# Altium project Sleek Imponator.PrjPcb
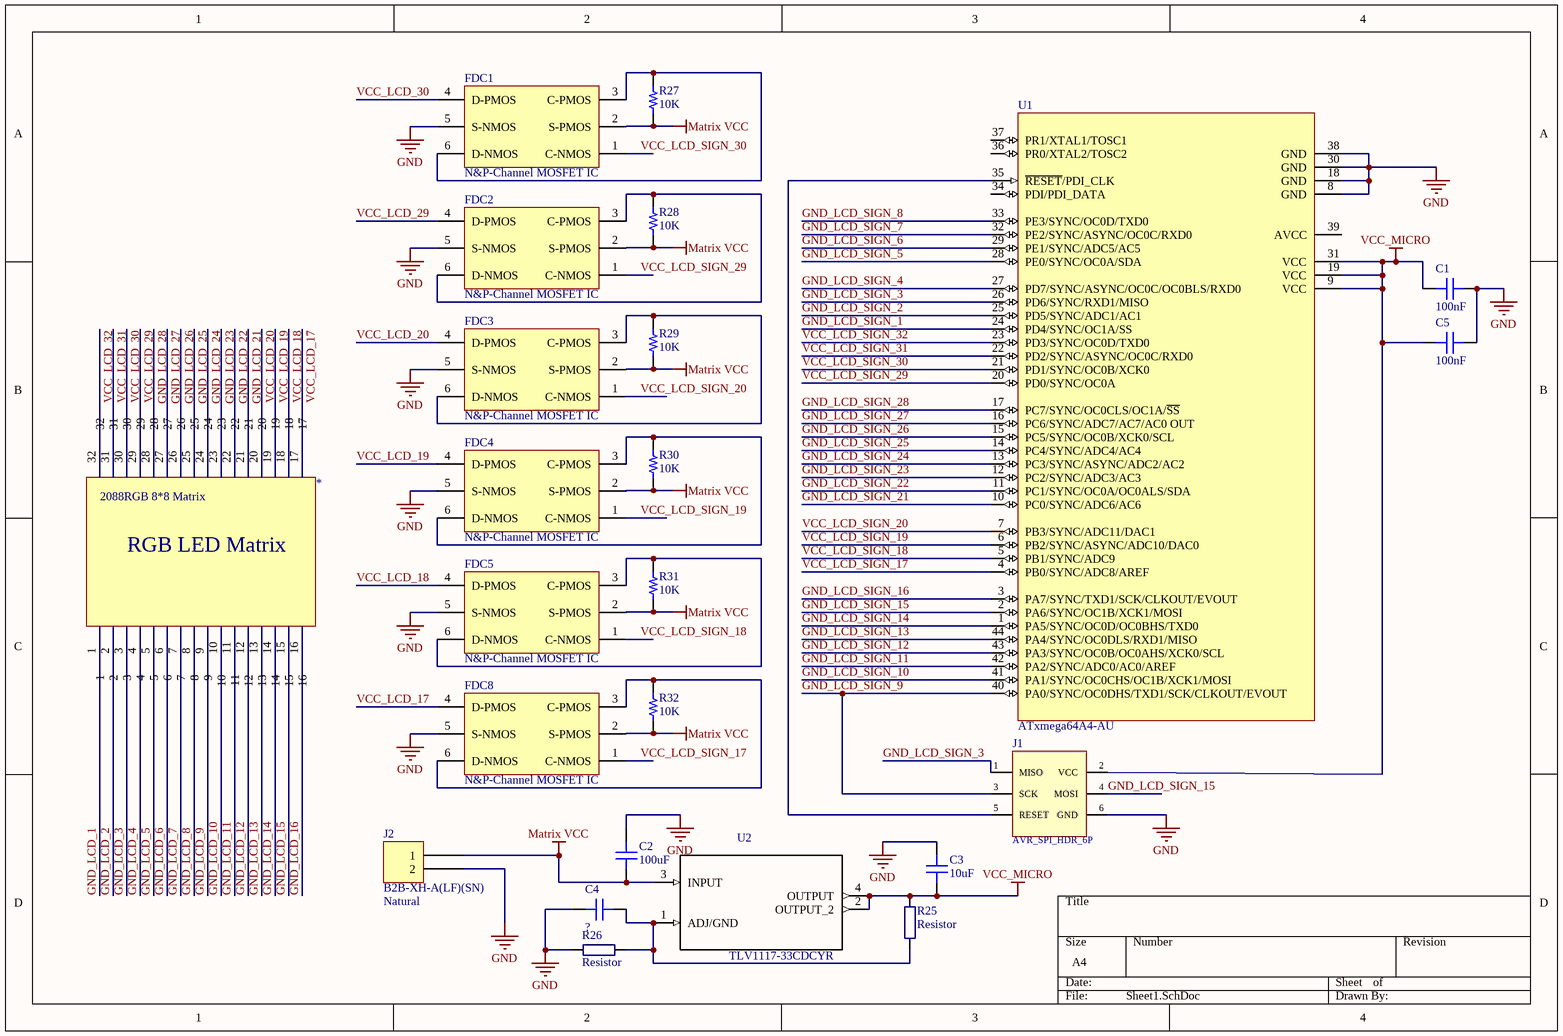
[diagram p0: Sheet1.SchDoc]
2 sheets, 76 parts. Net scope: global (net labels, ports and power ports of the same name join across sheets).
Board file: PCB1.PcbDoc
Sheets:
  Sheet1.SchDoc
  Sheet2.SchDoc

## Sheet Sheet1.SchDoc
size A4

### Parts
*  2088RGB 8*8 Matrix  [PCBComponent_1]
C1  100nF  [CAP 0603/1608]
C2  100uF  [CAP 0603/1608]
C3  10uF  [CAP 0603/1608]
C4  ?  [CAP 0603/1608]
C5  100nF  [CAP 0603/1608]
FDC1  N&P-Channel MOSFET IC  [SSOT-6]
FDC2  N&P-Channel MOSFET IC  [SSOT-6]
FDC3  N&P-Channel MOSFET IC  [SSOT-6]
FDC4  N&P-Channel MOSFET IC  [SSOT-6]
FDC5  N&P-Channel MOSFET IC  [SSOT-6]
FDC8  N&P-Channel MOSFET IC  [SSOT-6]
J1  AVR_SPI_HDR_6P  [HEADER_3x2]
J2  B2B-XH-A(LF)(SN)  Colour: Natural  [JST XH B2B-XH-A]
R25  Resistor  [RESC0603(1608)_N]
R26  Resistor  [RESC0603(1608)_N]
R27  10K  [RES 0603/1608]
R28  10K  [RES 0603/1608]
R29  10K  [RES 0603/1608]
R30  10K  [RES 0603/1608]
R31  10K  [RES 0603/1608]
R32  10K  [RES 0603/1608]
U1  ATxmega64A4-AU  [44A_N]
U2  TLV1117-33CDCYR  [SOT230P700X180-4N]

### Nets
GND: C1.2 C2.2 C3.2 C4.2 C5.2 FDC1.5(S-NMOS) FDC2.5(S-NMOS) FDC3.5(S-NMOS) FDC4.5(S-NMOS) FDC5.5(S-NMOS) FDC8.5(S-NMOS) J1.6(GND) J2.2 R26.1 U1.8(GND) U1.18(GND) U1.30(GND) U1.38(GND)
Matrix VCC: C2.1 FDC1.2(S-PMOS) FDC2.2(S-PMOS) FDC3.2(S-PMOS) FDC4.2(S-PMOS) FDC5.2(S-PMOS) FDC8.2(S-PMOS) J2.1 R27.1 R28.1 R29.1 R30.1 R31.1 R32.1 U2.3(INPUT)
VCC_MICRO: C1.1 C3.1 C5.1 J1.2(VCC) R25.2 U1.9(VCC) U1.19(VCC) U1.31(VCC) U2.2(OUTPUT_2) U2.4(OUTPUT)
GND_LCD_1: *.1
GND_LCD_2: *.2
GND_LCD_3: *.3
GND_LCD_4: *.4
GND_LCD_5: *.5
GND_LCD_6: *.6
GND_LCD_7: *.7
GND_LCD_8: *.8
GND_LCD_9: *.9
GND_LCD_10: *.10
GND_LCD_11: *.11
GND_LCD_12: *.12
GND_LCD_13: *.13
GND_LCD_14: *.14
GND_LCD_15: *.15
GND_LCD_16: *.16
GND_LCD_21: *.21
GND_LCD_22: *.22
GND_LCD_23: *.23
GND_LCD_24: *.24
GND_LCD_25: *.25
GND_LCD_26: *.26
GND_LCD_27: *.27
GND_LCD_28: *.28
GND_LCD_SIGN_1: U1.24(PD4/SYNC/OC1A/SS)
GND_LCD_SIGN_2: U1.25(PD5/SYNC/ADC1/AC1)
GND_LCD_SIGN_3: J1.1(MISO) U1.26(PD6/SYNC/RXD1/MISO)
GND_LCD_SIGN_4: U1.27(PD7/SYNC/ASYNC/OC0C/OC0BLS/RXD0)
GND_LCD_SIGN_5: U1.28(PE0/SYNC/OC0A/SDA)
GND_LCD_SIGN_6: U1.29(PE1/SYNC/ADC5/AC5)
GND_LCD_SIGN_7: U1.32(PE2/SYNC/ASYNC/OC0C/RXD0)
GND_LCD_SIGN_8: U1.33(PE3/SYNC/OC0D/TXD0)
GND_LCD_SIGN_9: J1.3(SCK) U1.40(PA0/SYNC/OC0DHS/TXD1/SCK/CLKOUT/EVOUT)
GND_LCD_SIGN_10: U1.41(PA1/SYNC/OC0CHS/OC1B/XCK1/MOSI)
GND_LCD_SIGN_11: U1.42(PA2/SYNC/ADC0/AC0/AREF)
GND_LCD_SIGN_12: U1.43(PA3/SYNC/OC0B/OC0AHS/XCK0/SCL)
GND_LCD_SIGN_13: U1.44(PA4/SYNC/OC0DLS/RXD1/MISO)
GND_LCD_SIGN_14: U1.1(PA5/SYNC/OC0D/OC0BHS/TXD0)
GND_LCD_SIGN_15: J1.4(MOSI) U1.2(PA6/SYNC/OC1B/XCK1/MOSI)
GND_LCD_SIGN_16: U1.3(PA7/SYNC/TXD1/SCK/CLKOUT/EVOUT)
GND_LCD_SIGN_21: U1.10(PC0/SYNC/ADC6/AC6)
GND_LCD_SIGN_22: U1.11(PC1/SYNC/OC0A/OC0ALS/SDA)
GND_LCD_SIGN_23: U1.12(PC2/SYNC/ADC3/AC3)
GND_LCD_SIGN_24: U1.13(PC3/SYNC/ASYNC/ADC2/AC2)
GND_LCD_SIGN_25: U1.14(PC4/SYNC/ADC4/AC4)
GND_LCD_SIGN_26: U1.15(PC5/SYNC/OC0B/XCK0/SCL)
GND_LCD_SIGN_27: U1.16(PC6/SYNC/ADC7/AC7/AC0_OUT)
GND_LCD_SIGN_28: U1.17(PC7/SYNC/OC0CLS/OC1A/~{SS})
VCC_LCD_17: *.17 FDC8.4(D-PMOS)
VCC_LCD_18: *.18 FDC5.4(D-PMOS)
VCC_LCD_19: *.19 FDC4.4(D-PMOS)
VCC_LCD_20: *.20 FDC3.4(D-PMOS)
VCC_LCD_29: *.29 FDC2.4(D-PMOS)
VCC_LCD_30: *.30 FDC1.4(D-PMOS)
VCC_LCD_31: *.31
VCC_LCD_32: *.32
VCC_LCD_SIGN_17: FDC8.1(C-NMOS) U1.4(PB0/SYNC/ADC8/AREF)
VCC_LCD_SIGN_18: FDC5.1(C-NMOS) U1.5(PB1/SYNC/ADC9)
VCC_LCD_SIGN_19: FDC4.1(C-NMOS) U1.6(PB2/SYNC/ASYNC/ADC10/DAC0)
VCC_LCD_SIGN_20: FDC3.1(C-NMOS) U1.7(PB3/SYNC/ADC11/DAC1)
VCC_LCD_SIGN_29: FDC2.1(C-NMOS) U1.20(PD0/SYNC/OC0A)
VCC_LCD_SIGN_30: FDC1.1(C-NMOS) U1.21(PD1/SYNC/OC0B/XCK0)
VCC_LCD_SIGN_31: U1.22(PD2/SYNC/ASYNC/OC0C/RXD0)
VCC_LCD_SIGN_32: U1.23(PD3/SYNC/OC0D/TXD0)
NetC4_1: C4.1 R25.1 R26.2 U2.1(ADJ/GND)
NetFDC1_3: FDC1.3(C-PMOS) FDC1.6(D-NMOS) R27.2
NetFDC2_3: FDC2.3(C-PMOS) FDC2.6(D-NMOS) R28.2
NetFDC3_3: FDC3.3(C-PMOS) FDC3.6(D-NMOS) R29.2
NetFDC4_3: FDC4.3(C-PMOS) FDC4.6(D-NMOS) R30.2
NetFDC5_3: FDC5.3(C-PMOS) FDC5.6(D-NMOS) R31.2
NetFDC8_3: FDC8.3(C-PMOS) FDC8.6(D-NMOS) R32.2
NetJ1_5: J1.5(RESET) U1.35(~{RESET}/PDI_CLK)

Not connected (* = marked no-connect by the designer): U1 34(PDI/PDI_DATA) 36(PR0/XTAL2/TOSC2) 37(PR1/XTAL1/TOSC1) 39(AVCC)

### Notes on the sheet
- (in symbol 2088RGB 8*8 Matrix) RGB LED Matrix

### Library data of the parts
* = 2088RGB 8*8 Matrix: 8*8 RGB Led Matrix; Model: 2088RGB-1; Schematic: http://selfbuilt.net/datasheets/2088RGB-5-datasheet.jpg
C1-C5 = C1608C0G1H820J080AA: CAP CER 82PF 50V C0G 0603; Manufacturer: TDK Corporation; TemperatureRange: -55C ~ 125C; TemperatureCoefficient: C0G, NP0; Tolerance: 5%; Supplier 1: Digi-Key; ComponentLink1Description: Datasheet; ComponentLink1URL: https://product.tdk.com/info/en/catalog/datasheets/mlcc_commercial_general_en.pdf; ComponentLink2Description: Digi-Key listing; Voltage: 50V; Type: -; Device Package: 0603 (1608 Metric)
  C1 C5: Value: 100nF
  C2: Value: 100uF
  C3: Value: 10uF
  C4: Value: ?
FDC1-FDC5 FDC8 = FDC633C: Schematic: http://www.mouser.com/ds/2/149/FDC6333C-1007236.pdf; Package: SSOT-8
J2 = B2B-XH-A(LF)(SN): CONN HEADER XH TOP 2POS 2.5MM; Manufacturer: JST Sales America Inc.; Pitch: 0.098" (2.50mm); Number Of Positions: 2; Part Number: B2B-XH-A(LF)(SN); PartId: 16449; Supplier 1: Digi-Key; Supplier Part Number 1: 455-2247-ND; ComponentLink1Description: Datasheet; ComponentLink1URL: http://www.jst-mfg.com/product/pdf/eng/eXH.pdf; ComponentLink2Description: Digi-Key Listing; ComponentLink2URL: http://www.digikey.com/product-detail/en/jst-sales-america-inc/B2B-XH-A(LF)(SN)/455-2247-ND/1651045; Price: 0,15; Type: Header, Shrouded; Contact Finish: Tin; Fastening Type: Detent Lock; Number Of Rows: 1; Series: XH
R27-R32 = ERJ-3EKF2320V: RES SMD 232 OHM 1% 1/10W 0603; Value: 10K; Part Number: ERJ-3EKF2320V
U1 = ATxmega64A4-AU: 8/16-bit AVR XMEGA A4 Microcontroller, 1.6-3.6V, 64KB + 4KB Flash, 2KB EEPROM, 4KB SRAM, 44-pin TQFP, Industrial Grade (-40°C to 85°C), Pb-Free; Published: 1-Apr-2010; DatasheetVersion: revN, Feb-2010; PackageVersion: rev.B, Oct-2001; PackageReference: 44A; Publisher: Altium Limited; PackageDescription: 44-Pin Plastic Thin Profile Quad Flat Pack, 10 x 10 x 1.0 mm Body, 0.8 mm Pitch (TQFP); Supplier 1: Digi-Key; Supplier Part Number 1: ATXMEGA64A4-AU-ND; Supplier 2: Farnell; Supplier Part Number 2: 1748560; Supplier 3: Mouser; Supplier Part Number 3: 556-ATXMEGA64A4-AU; ComponentLink1Description: Manufacturer Link; ComponentLink1URL: http://www.atmel.com/products/avr/default.asp?; ComponentLink2Description: ATxmega16A4/32A4/64A4/128A4 Datasheet; ComponentLink2URL: http://www.atmel.com/dyn/resources/prod_documents/doc8069.pdf; ComponentLink3Description: Atmel.com Home; ComponentLink3URL: http://www.atmel.com
U2 = TLV1117-33CDCYR: IC REG LIN 3.3V 800MA SOT223-4; MF: Texas Instruments; Availability: Good; Price: 0.35 USD; Package: SOT-223-4 Texas Instruments; MP: TLV1117-33CDCYR; Value: *
R25 R26 = Resistor: Value: ?

## Sheet Sheet2.SchDoc
size A4
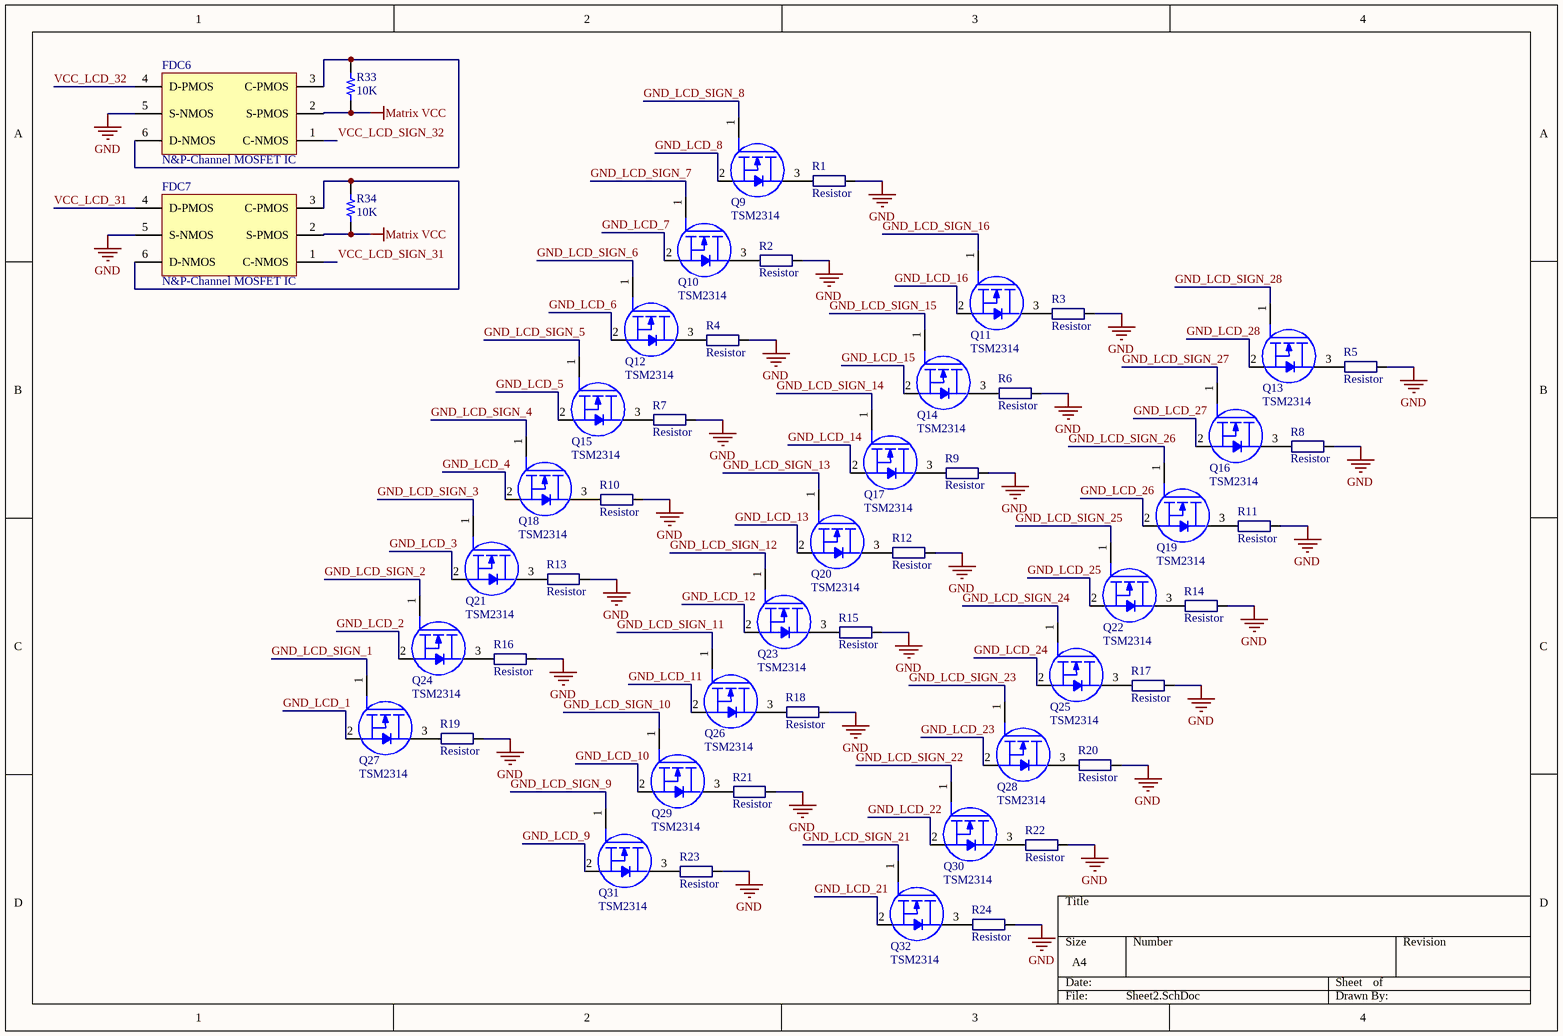
[diagram p1: Sheet2.SchDoc]

### Parts
FDC6  N&P-Channel MOSFET IC  [SSOT-6]
FDC7  N&P-Channel MOSFET IC  [SSOT-6]
Q9  TSM2314  [SOT95P280X130-3N]
Q10  TSM2314  [SOT95P280X130-3N]
Q11  TSM2314  [SOT95P280X130-3N]
Q12  TSM2314  [SOT95P280X130-3N]
Q13  TSM2314  [SOT95P280X130-3N]
Q14  TSM2314  [SOT95P280X130-3N]
Q15  TSM2314  [SOT95P280X130-3N]
Q16  TSM2314  [SOT95P280X130-3N]
Q17  TSM2314  [SOT95P280X130-3N]
Q18  TSM2314  [SOT95P280X130-3N]
Q19  TSM2314  [SOT95P280X130-3N]
Q20  TSM2314  [SOT95P280X130-3N]
Q21  TSM2314  [SOT95P280X130-3N]
Q22  TSM2314  [SOT95P280X130-3N]
Q23  TSM2314  [SOT95P280X130-3N]
Q24  TSM2314  [SOT95P280X130-3N]
Q25  TSM2314  [SOT95P280X130-3N]
Q26  TSM2314  [SOT95P280X130-3N]
Q27  TSM2314  [SOT95P280X130-3N]
Q28  TSM2314  [SOT95P280X130-3N]
Q29  TSM2314  [SOT95P280X130-3N]
Q30  TSM2314  [SOT95P280X130-3N]
Q31  TSM2314  [SOT95P280X130-3N]
Q32  TSM2314  [SOT95P280X130-3N]
R1  Resistor  [RESC0603(1608)_N]
R2  Resistor  [RESC0603(1608)_N]
R3  Resistor  [RESC0603(1608)_N]
R4  Resistor  [RESC0603(1608)_N]
R5  Resistor  [RESC0603(1608)_N]
R6  Resistor  [RESC0603(1608)_N]
R7  Resistor  [RESC0603(1608)_N]
R8  Resistor  [RESC0603(1608)_N]
R9  Resistor  [RESC0603(1608)_N]
R10  Resistor  [RESC0603(1608)_N]
R11  Resistor  [RESC0603(1608)_N]
R12  Resistor  [RESC0603(1608)_N]
R13  Resistor  [RESC0603(1608)_N]
R14  Resistor  [RESC0603(1608)_N]
R15  Resistor  [RESC0603(1608)_N]
R16  Resistor  [RESC0603(1608)_N]
R17  Resistor  [RESC0603(1608)_N]
R18  Resistor  [RESC0603(1608)_N]
R19  Resistor  [RESC0603(1608)_N]
R20  Resistor  [RESC0603(1608)_N]
R21  Resistor  [RESC0603(1608)_N]
R22  Resistor  [RESC0603(1608)_N]
R23  Resistor  [RESC0603(1608)_N]
R24  Resistor  [RESC0603(1608)_N]
R33  10K  [RES 0603/1608]
R34  10K  [RES 0603/1608]

### Nets
GND: FDC6.5(S-NMOS) FDC7.5(S-NMOS) R1.2 R2.2 R3.2 R4.2 R5.2 R6.2 R7.2 R8.2 R9.2 R10.2 R11.2 R12.2 R13.2 R14.2 R15.2 R16.2 R17.2 R18.2 R19.2 R20.2 R21.2 R22.2 R23.2 R24.2
Matrix VCC: FDC6.2(S-PMOS) FDC7.2(S-PMOS) R33.1 R34.1
GND_LCD_1: Q27.2(Source)
GND_LCD_2: Q24.2(Source)
GND_LCD_3: Q21.2(Source)
GND_LCD_4: Q18.2(Source)
GND_LCD_5: Q15.2(Source)
GND_LCD_6: Q12.2(Source)
GND_LCD_7: Q10.2(Source)
GND_LCD_8: Q9.2(Source)
GND_LCD_9: Q31.2(Source)
GND_LCD_10: Q29.2(Source)
GND_LCD_11: Q26.2(Source)
GND_LCD_12: Q23.2(Source)
GND_LCD_13: Q20.2(Source)
GND_LCD_14: Q17.2(Source)
GND_LCD_15: Q14.2(Source)
GND_LCD_16: Q11.2(Source)
GND_LCD_21: Q32.2(Source)
GND_LCD_22: Q30.2(Source)
GND_LCD_23: Q28.2(Source)
GND_LCD_24: Q25.2(Source)
GND_LCD_25: Q22.2(Source)
GND_LCD_26: Q19.2(Source)
GND_LCD_27: Q16.2(Source)
GND_LCD_28: Q13.2(Source)
GND_LCD_SIGN_1: Q27.1(Gate)
GND_LCD_SIGN_2: Q24.1(Gate)
GND_LCD_SIGN_3: Q21.1(Gate)
GND_LCD_SIGN_4: Q18.1(Gate)
GND_LCD_SIGN_5: Q15.1(Gate)
GND_LCD_SIGN_6: Q12.1(Gate)
GND_LCD_SIGN_7: Q10.1(Gate)
GND_LCD_SIGN_8: Q9.1(Gate)
GND_LCD_SIGN_9: Q31.1(Gate)
GND_LCD_SIGN_10: Q29.1(Gate)
GND_LCD_SIGN_11: Q26.1(Gate)
GND_LCD_SIGN_12: Q23.1(Gate)
GND_LCD_SIGN_13: Q20.1(Gate)
GND_LCD_SIGN_14: Q17.1(Gate)
GND_LCD_SIGN_15: Q14.1(Gate)
GND_LCD_SIGN_16: Q11.1(Gate)
GND_LCD_SIGN_21: Q32.1(Gate)
GND_LCD_SIGN_22: Q30.1(Gate)
GND_LCD_SIGN_23: Q28.1(Gate)
GND_LCD_SIGN_24: Q25.1(Gate)
GND_LCD_SIGN_25: Q22.1(Gate)
GND_LCD_SIGN_26: Q19.1(Gate)
GND_LCD_SIGN_27: Q16.1(Gate)
GND_LCD_SIGN_28: Q13.1(Gate)
VCC_LCD_31: FDC7.4(D-PMOS)
VCC_LCD_32: FDC6.4(D-PMOS)
VCC_LCD_SIGN_31: FDC7.1(C-NMOS)
VCC_LCD_SIGN_32: FDC6.1(C-NMOS)
NetFDC6_3: FDC6.3(C-PMOS) FDC6.6(D-NMOS) R33.2
NetFDC7_3: FDC7.3(C-PMOS) FDC7.6(D-NMOS) R34.2
NetQ9_3: Q9.3(Drain) R1.1
NetQ10_3: Q10.3(Drain) R2.1
NetQ11_3: Q11.3(Drain) R3.1
NetQ12_3: Q12.3(Drain) R4.1
NetQ13_3: Q13.3(Drain) R5.1
NetQ14_3: Q14.3(Drain) R6.1
NetQ15_3: Q15.3(Drain) R7.1
NetQ16_3: Q16.3(Drain) R8.1
NetQ17_3: Q17.3(Drain) R9.1
NetQ18_3: Q18.3(Drain) R10.1
NetQ19_3: Q19.3(Drain) R11.1
NetQ20_3: Q20.3(Drain) R12.1
NetQ21_3: Q21.3(Drain) R13.1
NetQ22_3: Q22.3(Drain) R14.1
NetQ23_3: Q23.3(Drain) R15.1
NetQ24_3: Q24.3(Drain) R16.1
NetQ25_3: Q25.3(Drain) R17.1
NetQ26_3: Q26.3(Drain) R18.1
NetQ27_3: Q27.3(Drain) R19.1
NetQ28_3: Q28.3(Drain) R20.1
NetQ29_3: Q29.3(Drain) R21.1
NetQ30_3: Q30.3(Drain) R22.1
NetQ31_3: Q31.3(Drain) R23.1
NetQ32_3: Q32.3(Drain) R24.1

### Library data of the parts
FDC6 FDC7 = FDC633C: Schematic: http://www.mouser.com/ds/2/149/FDC6333C-1007236.pdf; Package: SSOT-8
Q9-Q32 = 2389: N-Channel MOSFET; id: 2389; pakke_opprettet_av: 774; pakke_opprettet: 11.07.2014 23.17.33; symbol_opprettet: 11.07.2014 23.17.04; leverandor_varenr: 1864589; pris: -1; produsent: Taiwan Semiconductor; leverandor: Farnell; pakketype: SOT; symbol_opprettet_av: 774; navn: TSM2314; nokkelord: mosfet
R1-R8 = Resistor: Value: 46R
R9-R24 = Resistor: Value: 24R
R33 R34 = ERJ-3EKF2320V: RES SMD 232 OHM 1% 1/10W 0603; Value: 10K; Part Number: ERJ-3EKF2320V

## Nets that join several sheets
GND: Sheet1 (18 pins), Sheet2 (26 pins)
Matrix VCC: Sheet1 (15 pins), Sheet2 (FDC6.2 FDC7.2 R33.1 R34.1)
GND_LCD_1: Sheet1 (*.1), Sheet2 (Q27.2)
GND_LCD_2: Sheet1 (*.2), Sheet2 (Q24.2)
GND_LCD_3: Sheet1 (*.3), Sheet2 (Q21.2)
GND_LCD_4: Sheet1 (*.4), Sheet2 (Q18.2)
GND_LCD_5: Sheet1 (*.5), Sheet2 (Q15.2)
GND_LCD_6: Sheet1 (*.6), Sheet2 (Q12.2)
GND_LCD_7: Sheet1 (*.7), Sheet2 (Q10.2)
GND_LCD_8: Sheet1 (*.8), Sheet2 (Q9.2)
GND_LCD_9: Sheet1 (*.9), Sheet2 (Q31.2)
GND_LCD_10: Sheet1 (*.10), Sheet2 (Q29.2)
GND_LCD_11: Sheet1 (*.11), Sheet2 (Q26.2)
GND_LCD_12: Sheet1 (*.12), Sheet2 (Q23.2)
GND_LCD_13: Sheet1 (*.13), Sheet2 (Q20.2)
GND_LCD_14: Sheet1 (*.14), Sheet2 (Q17.2)
GND_LCD_15: Sheet1 (*.15), Sheet2 (Q14.2)
GND_LCD_16: Sheet1 (*.16), Sheet2 (Q11.2)
GND_LCD_21: Sheet1 (*.21), Sheet2 (Q32.2)
GND_LCD_22: Sheet1 (*.22), Sheet2 (Q30.2)
GND_LCD_23: Sheet1 (*.23), Sheet2 (Q28.2)
GND_LCD_24: Sheet1 (*.24), Sheet2 (Q25.2)
GND_LCD_25: Sheet1 (*.25), Sheet2 (Q22.2)
GND_LCD_26: Sheet1 (*.26), Sheet2 (Q19.2)
GND_LCD_27: Sheet1 (*.27), Sheet2 (Q16.2)
GND_LCD_28: Sheet1 (*.28), Sheet2 (Q13.2)
GND_LCD_SIGN_1: Sheet1 (U1.24), Sheet2 (Q27.1)
GND_LCD_SIGN_2: Sheet1 (U1.25), Sheet2 (Q24.1)
GND_LCD_SIGN_3: Sheet1 (J1.1 U1.26), Sheet2 (Q21.1)
GND_LCD_SIGN_4: Sheet1 (U1.27), Sheet2 (Q18.1)
GND_LCD_SIGN_5: Sheet1 (U1.28), Sheet2 (Q15.1)
GND_LCD_SIGN_6: Sheet1 (U1.29), Sheet2 (Q12.1)
GND_LCD_SIGN_7: Sheet1 (U1.32), Sheet2 (Q10.1)
GND_LCD_SIGN_8: Sheet1 (U1.33), Sheet2 (Q9.1)
GND_LCD_SIGN_9: Sheet1 (J1.3 U1.40), Sheet2 (Q31.1)
GND_LCD_SIGN_10: Sheet1 (U1.41), Sheet2 (Q29.1)
GND_LCD_SIGN_11: Sheet1 (U1.42), Sheet2 (Q26.1)
GND_LCD_SIGN_12: Sheet1 (U1.43), Sheet2 (Q23.1)
GND_LCD_SIGN_13: Sheet1 (U1.44), Sheet2 (Q20.1)
GND_LCD_SIGN_14: Sheet1 (U1.1), Sheet2 (Q17.1)
GND_LCD_SIGN_15: Sheet1 (J1.4 U1.2), Sheet2 (Q14.1)
GND_LCD_SIGN_16: Sheet1 (U1.3), Sheet2 (Q11.1)
GND_LCD_SIGN_21: Sheet1 (U1.10), Sheet2 (Q32.1)
GND_LCD_SIGN_22: Sheet1 (U1.11), Sheet2 (Q30.1)
GND_LCD_SIGN_23: Sheet1 (U1.12), Sheet2 (Q28.1)
GND_LCD_SIGN_24: Sheet1 (U1.13), Sheet2 (Q25.1)
GND_LCD_SIGN_25: Sheet1 (U1.14), Sheet2 (Q22.1)
GND_LCD_SIGN_26: Sheet1 (U1.15), Sheet2 (Q19.1)
GND_LCD_SIGN_27: Sheet1 (U1.16), Sheet2 (Q16.1)
GND_LCD_SIGN_28: Sheet1 (U1.17), Sheet2 (Q13.1)
VCC_LCD_31: Sheet1 (*.31), Sheet2 (FDC7.4)
VCC_LCD_32: Sheet1 (*.32), Sheet2 (FDC6.4)
VCC_LCD_SIGN_31: Sheet1 (U1.22), Sheet2 (FDC7.1)
VCC_LCD_SIGN_32: Sheet1 (U1.23), Sheet2 (FDC6.1)